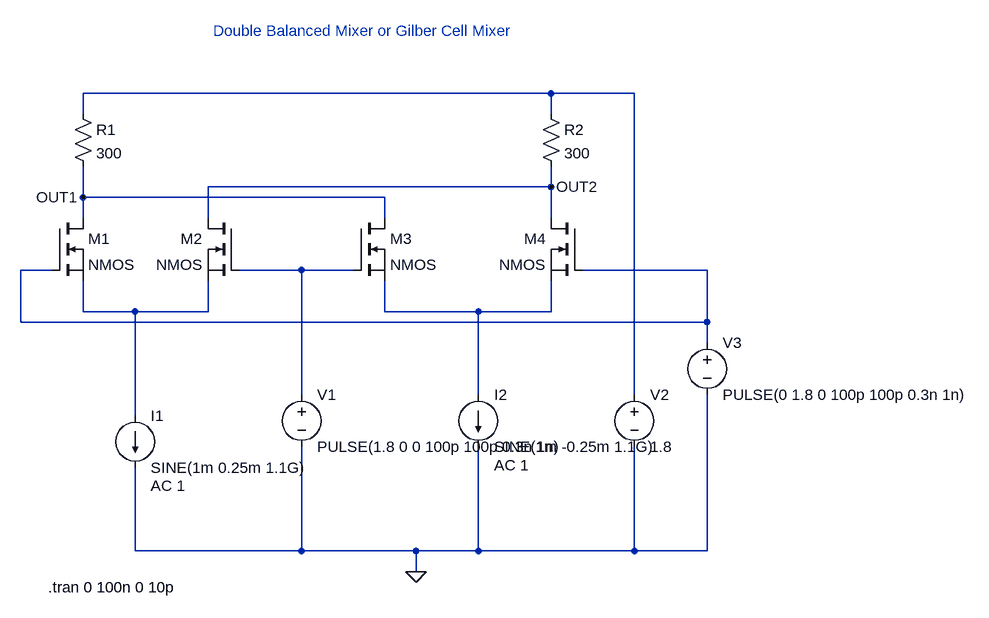
[diagram p0: schematic gilbertcell_ltspice.asc]
gilbertcell_ltspice.asc, the LTspice schematic file:
Version 4
SHEET 1 1548 680
WIRE 880 -96 160 -96
WIRE 1008 -96 880 -96
WIRE 160 -64 160 -96
WIRE 880 -64 880 -96
WIRE 880 48 880 16
WIRE 880 48 352 48
WIRE 160 64 160 16
WIRE 624 64 160 64
WIRE 160 96 160 64
WIRE 352 96 352 48
WIRE 624 96 624 64
WIRE 880 96 880 48
WIRE 112 176 64 176
WIRE 496 176 400 176
WIRE 576 176 496 176
WIRE 1120 176 928 176
WIRE 160 240 160 192
WIRE 240 240 160 240
WIRE 352 240 352 192
WIRE 352 240 240 240
WIRE 624 240 624 192
WIRE 768 240 624 240
WIRE 880 240 880 192
WIRE 880 240 768 240
WIRE 64 256 64 176
WIRE 1120 256 1120 176
WIRE 1120 256 64 256
WIRE 1120 288 1120 256
WIRE 496 368 496 176
WIRE 768 368 768 240
WIRE 1008 368 1008 -96
WIRE 240 400 240 240
WIRE 240 608 240 480
WIRE 496 608 496 448
WIRE 496 608 240 608
WIRE 672 608 496 608
WIRE 768 608 768 448
WIRE 768 608 672 608
WIRE 1008 608 1008 448
WIRE 1008 608 768 608
WIRE 1120 608 1120 368
WIRE 1120 608 1008 608
WIRE 672 640 672 608
FLAG 672 640 0
FLAG 160 64 OUT1
FLAG 880 48 OUT2
SYMBOL res 144 -80 R0
SYMATTR InstName R1
SYMATTR Value 300
SYMBOL res 864 -80 R0
SYMATTR InstName R2
SYMATTR Value 300
SYMBOL current 240 400 R0
WINDOW 123 24 108 Left 2
WINDOW 39 0 0 Left 0
SYMATTR InstName I1
SYMATTR Value SINE(1m 0.25m 1.1G)
SYMATTR Value2 AC 1
SYMBOL current 768 368 R0
WINDOW 123 24 108 Left 2
WINDOW 39 0 0 Left 0
SYMATTR InstName I2
SYMATTR Value SINE(1m -0.25m 1.1G)
SYMATTR Value2 AC 1
SYMBOL voltage 496 352 R0
WINDOW 123 0 0 Left 0
WINDOW 39 0 0 Left 0
SYMATTR InstName V1
SYMATTR Value PULSE(1.8 0 0 100p 100p 0.3n 1n)
SYMBOL voltage 1008 352 R0
WINDOW 123 0 0 Left 0
WINDOW 39 0 0 Left 0
SYMATTR InstName V2
SYMATTR Value 1.8
SYMBOL voltage 1120 272 R0
WINDOW 123 0 0 Left 0
WINDOW 39 0 0 Left 0
SYMATTR InstName V3
SYMATTR Value PULSE(0 1.8 0 100p 100p 0.3n 1n)
SYMBOL nmos 112 96 R0
SYMATTR InstName M1
SYMBOL nmos 400 96 M0
SYMATTR InstName M2
SYMBOL nmos 576 96 R0
SYMATTR InstName M3
SYMBOL nmos 928 96 M0
SYMATTR InstName M4
TEXT 106 664 Left 2 !.tran 0 100n 0 10p
TEXT 360 -192 Left 2 ;Double Balanced Mixer or Gilber Cell Mixer

The netlist it stands for:
* gilbertcell_ltspice.asc
R1 N001 OUT1 300
R2 N001 OUT2 300
I1 N004 0 SINE(1m 0.25m 1.1G) AC 1
I2 N005 0 SINE(1m -0.25m 1.1G) AC 1
V1 N003 0 PULSE(1.8 0 0 100p 100p 0.3n 1n)
V2 N001 0 1.8
V3 N002 0 PULSE(0 1.8 0 100p 100p 0.3n 1n)
M1 OUT1 N002 N004 N004 NMOS
M2 OUT2 N003 N004 N004 NMOS
M3 OUT1 N003 N005 N005 NMOS
M4 OUT2 N002 N005 N005 NMOS
.model NMOS NMOS
.model PMOS PMOS
.lib standard.mos
.tran 0 100n 0 10p
* Double Balanced Mixer or Gilber Cell Mixer
.backanno
.end